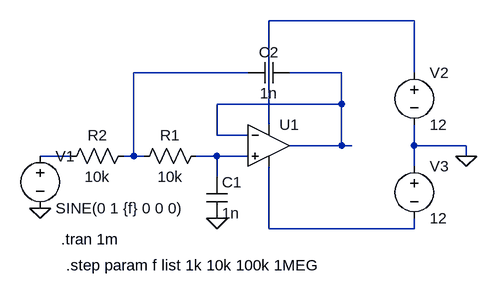
[diagram p0: schematic Exp2_LPF.asc]
Exp2_LPF.asc, the LTspice schematic file:
Version 4
SHEET 1 880 680
WIRE 544 -64 320 -64
WIRE 288 16 112 16
WIRE 432 16 352 16
WIRE 544 16 544 -64
WIRE 432 64 432 16
WIRE 432 64 240 64
WIRE 320 96 320 -64
WIRE 240 112 240 64
WIRE 288 112 240 112
WIRE 432 128 432 64
WIRE 432 128 352 128
WIRE 448 128 432 128
WIRE 544 128 544 96
WIRE 624 128 544 128
WIRE 16 144 -32 144
WIRE 112 144 112 16
WIRE 112 144 96 144
WIRE 128 144 112 144
WIRE 240 144 208 144
WIRE 288 144 240 144
WIRE 624 144 624 128
WIRE 544 160 544 128
WIRE 240 176 240 144
WIRE 320 256 320 160
WIRE 544 256 544 240
WIRE 544 256 320 256
FLAG 240 240 0
FLAG -32 224 0
FLAG 624 144 0
SYMBOL cap 224 176 R0
SYMATTR InstName C1
SYMATTR Value 1n
SYMBOL res 224 128 R90
WINDOW 0 0 56 VBottom 2
WINDOW 3 32 56 VTop 2
SYMATTR InstName R1
SYMATTR Value 10k
SYMBOL res 112 128 R90
WINDOW 0 0 56 VBottom 2
WINDOW 3 32 56 VTop 2
SYMATTR InstName R2
SYMATTR Value 10k
SYMBOL cap 352 0 R90
WINDOW 0 0 32 VBottom 2
WINDOW 3 32 32 VTop 2
SYMATTR InstName C2
SYMATTR Value 1n
SYMBOL OpAmps\\UniversalOpAmp 320 128 R0
SYMATTR InstName U1
SYMBOL voltage 544 0 R0
WINDOW 123 0 0 Left 0
WINDOW 39 0 0 Left 0
SYMATTR InstName V2
SYMATTR Value 12
SYMBOL voltage 544 144 R0
WINDOW 123 0 0 Left 0
WINDOW 39 0 0 Left 0
SYMATTR InstName V3
SYMATTR Value 12
SYMBOL voltage -32 128 R0
WINDOW 123 0 0 Left 0
WINDOW 39 0 0 Left 0
SYMATTR InstName V1
SYMATTR Value SINE(0 1 {f} 0 0 0)
TEXT 0 272 Left 2 !.tran 1m
TEXT 8 312 Left 2 !.step param f list 1k 10k 100k 1MEG

The netlist it stands for:
* Exp2_LPF.asc
C1 N005 0 1n
R1 N005 N002 10k
R2 N002 N004 10k
C2 N003 N002 1n
XU1 N005 N003 N001 N006 N003 level1 Avol=1Meg GBW=10Meg Vos=0 En=0 Enk=0 In=0 Ink=0 Rin=500Meg  ; pins In+ In- V+ V- OUT
V2 N001 0 12
V3 0 N006 12
V1 N004 0 SINE(0 1 {f} 0 0 0)
.tran 1m
.step param f list 1k 10k 100k 1MEG
.lib UniversalOpAmp1.lib
.backanno
.end